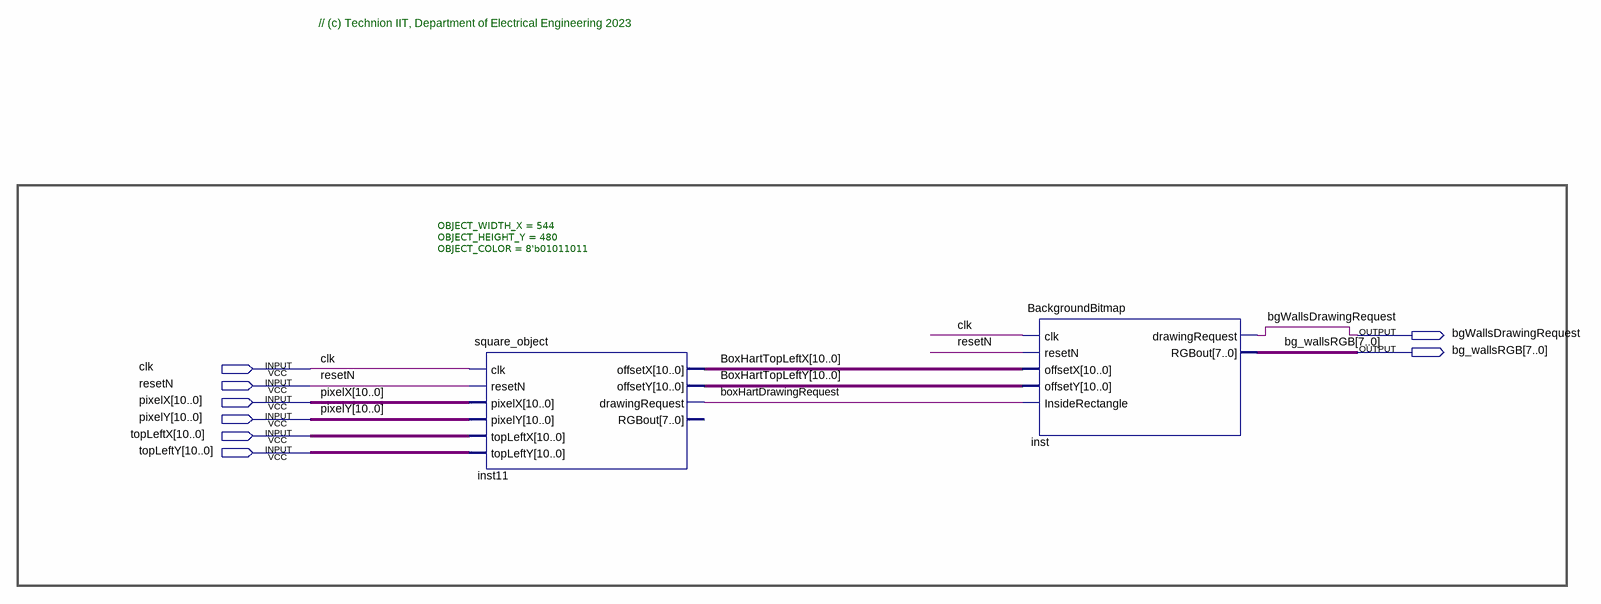
[diagram p0: schematic sheet]
// Quartus schematic BACKGROUND_DISPLAY.bdf as structural Verilog: 2 symbols, 8 pins
module BACKGROUND_DISPLAY (
  input  clk,
  input  resetN,
  input  [10:0] pixelX,
  input  [10:0] pixelY,
  input  [10:0] topLeftX,
  input  [10:0] topLeftY,
  output bgWallsDrawingRequest,
  output [7:0] bg_wallsRGB
);

  wire boxHartDrawingRequest;
  wire [10:0] BoxHartTopLeftX, BoxHartTopLeftY;

  square_object #(.OBJECT_WIDTH_X(544), .OBJECT_HEIGHT_Y(480), .OBJECT_COLOR(8'b01011011)) inst11 (
    .clk(clk), .resetN(resetN), .pixelX(pixelX), .pixelY(pixelY), .topLeftX(topLeftX), .topLeftY(topLeftY),
    .offsetX(BoxHartTopLeftX), .offsetY(BoxHartTopLeftY), .drawingRequest(boxHartDrawingRequest));  // open: RGBout
  BackgroundBitmap inst (
    .clk(clk), .resetN(resetN), .offsetX(BoxHartTopLeftX), .offsetY(BoxHartTopLeftY),
    .InsideRectangle(boxHartDrawingRequest), .drawingRequest(bgWallsDrawingRequest), .RGBout(bg_wallsRGB));

  // Notes on the sheet:
  //   // (c) Technion IIT, Department of Electrical Engineering 2023
endmodule
